# EasyEDA Pro project ProPrj_DiscoTech 6 Current_2026-05-06.epro, schematic Power Supply

## Sheets
1 Transformer: Board Name: Power Supply; Create Date: 2025-11-03; Page Name: Transformer; Project Name: Bozak Clone Rev 7; Schematic Name: Power Supply; Update Date: 2025-11-05; Company: EasyEDA.com; Page Size: A4; Version: V1.0
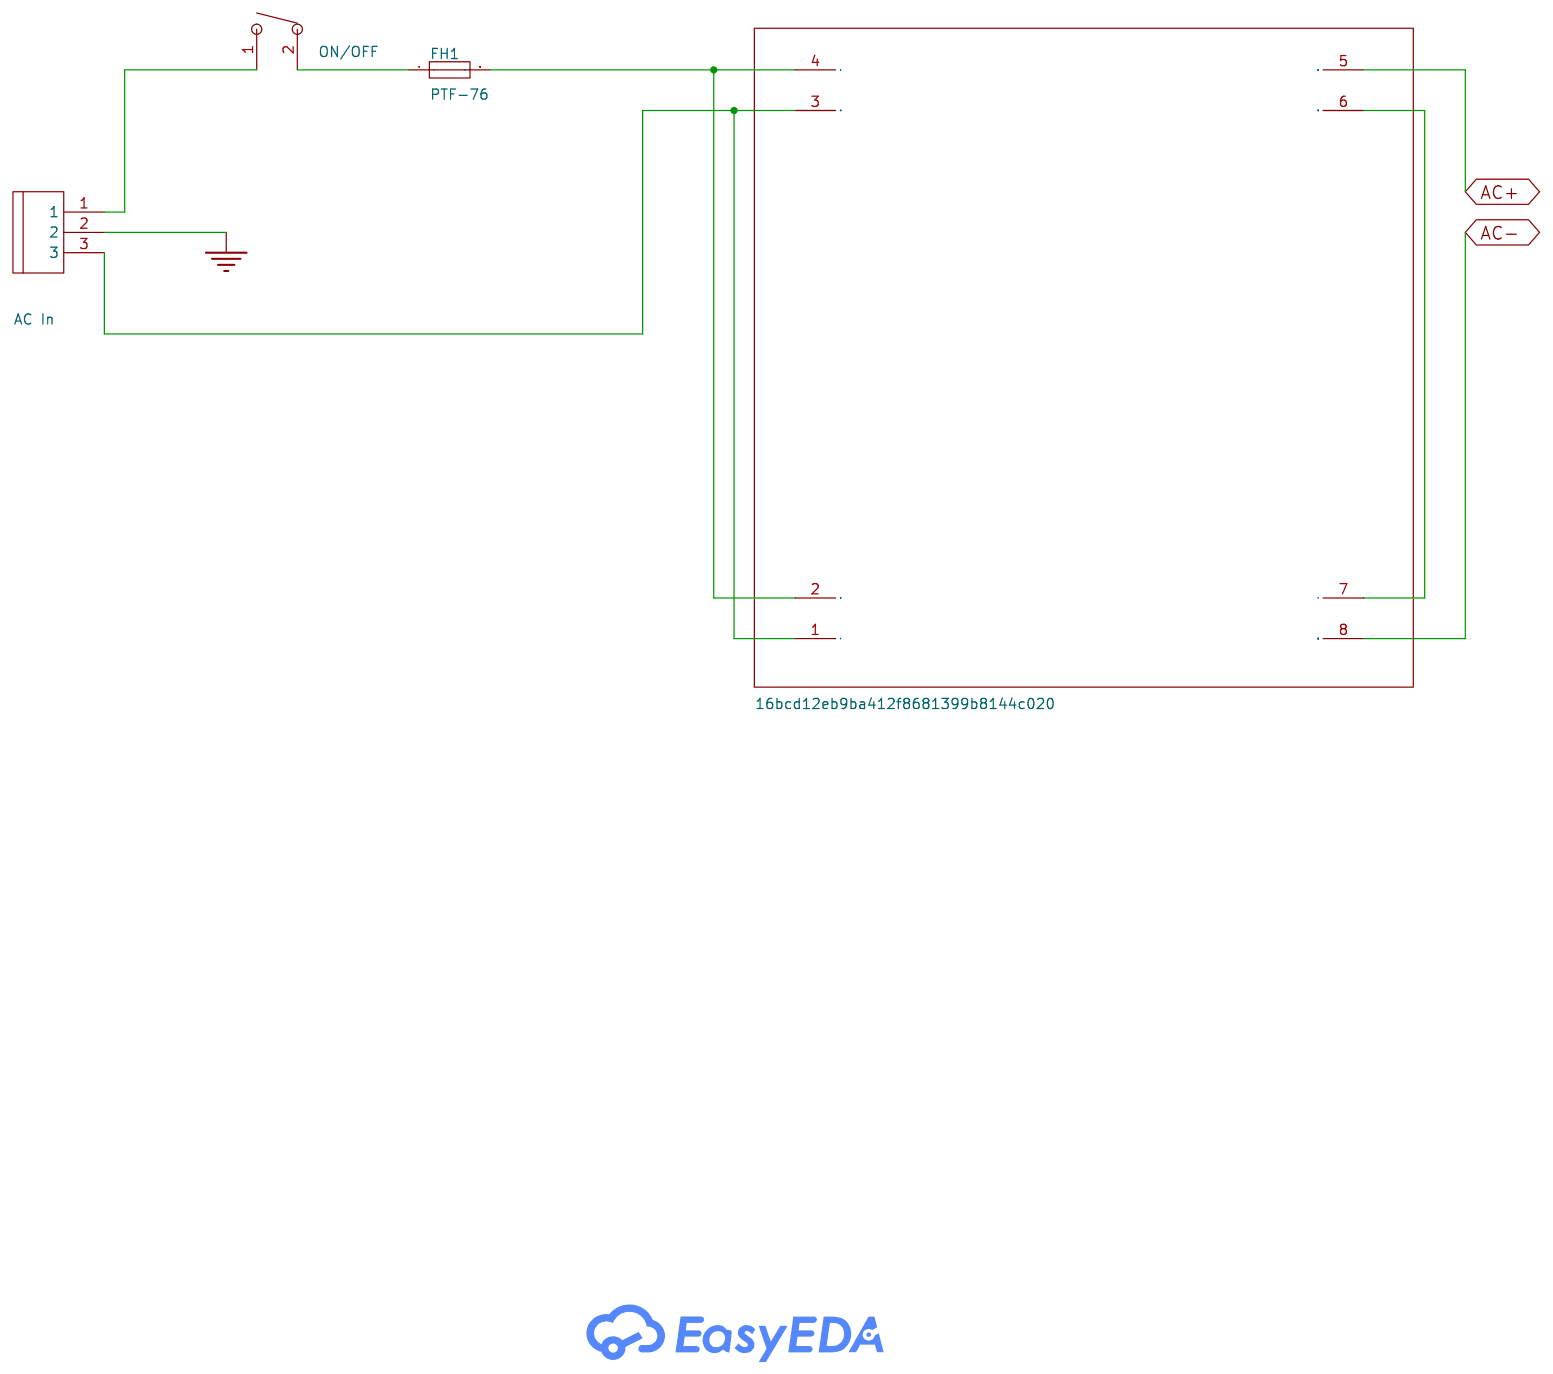
[diagram p12: Transformer]
2 Rectifier: Create Date: 2025-11-05; Page Name: Rectifier; Update Date: 2025-11-07
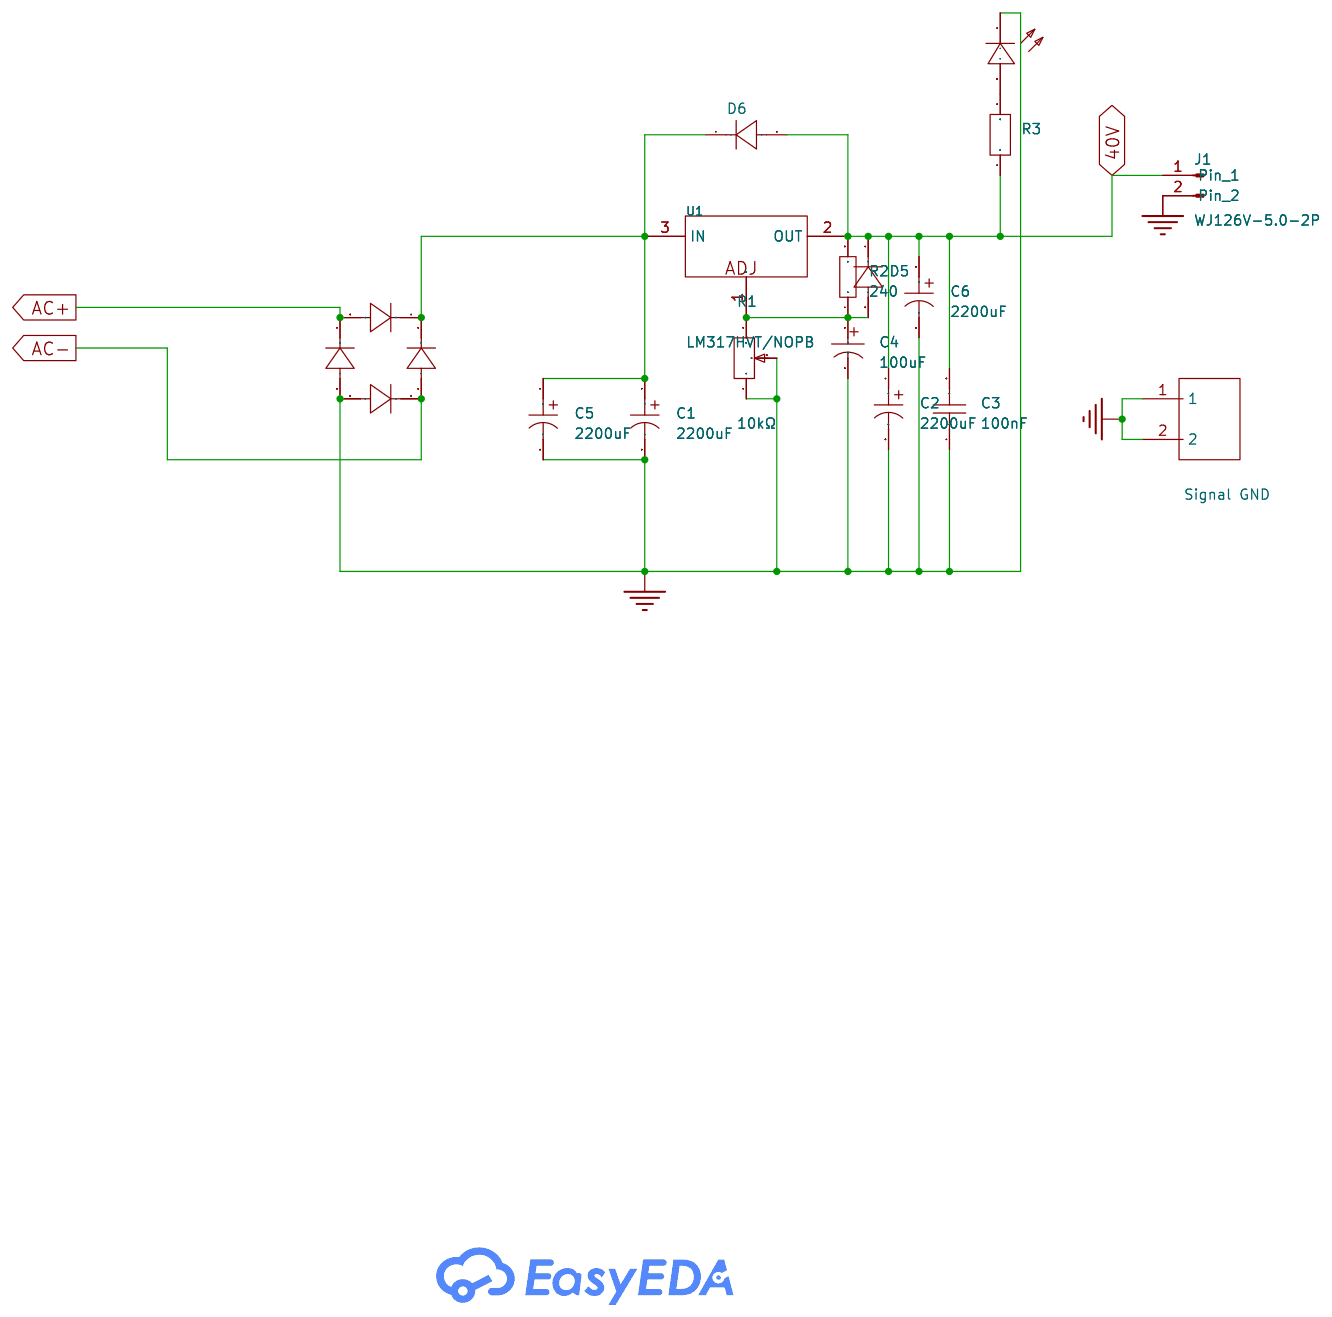
[diagram p13: Rectifier]

## Parts
sheet Rectifier
C1  2200uF  [CAP-TH_BD16.0-P7.50-D1.2-FD]
C2  2200uF  [CAP-TH_BD16.0-P7.50-D1.2-FD]
C3  100nF  [CAP-TH_L7.0-W3.2-P5.08-D0.6-S2.7]
C4  100uF  [CAP-TH_BD8.0-P3.50-D0.6-FD_1]
C5  2200uF  [CAP-TH_BD16.0-P7.50-D1.2-FD]
C6  2200uF  [CAP-TH_BD16.0-P7.50-D1.2-FD]
D1  MUR420  [DO-201AD_BD5.3-L8.4-P12.50-D1.4-RD]
D2  MUR420  [DO-201AD_BD5.3-L8.4-P12.50-D1.4-RD]
D3  MUR420  [DO-201AD_BD5.3-L8.4-P12.50-D1.4-RD]
D4  MUR420  [DO-201AD_BD5.3-L8.4-P12.50-D1.4-RD]
D5  -  [DO-41_BD2.4-L4.7-P8.70-D0.9-RD]
D6  -  [DO-41_BD2.4-L4.7-P8.70-D0.9-RD]
D7  DB125-2.54-2P-GN-S  [CONN-TH_DB125-2.54-2P-GN]
J1  DC 40v  [CONN-TH_WJ126V-5.0-2P]
P5  Signal GND  [CONN-TH_WJ126V-5.0-2P]
R1  10kΩ  [RES-ADJ-TH_3296W]
R2  240  [RES-TH_BD2.2-L6.5-P10.50-D0.6]
R3  2.2kΩ  [RES-TH_BD7.5-L18.0-P22.00-D1.0]
U1  LM317HVT/NOPB  [TO-220-3_L10.0-W4.5-P2.54-L]
sheet Transformer
CN2  AC In  [CONN-TH_3P-P5.0-MX301-5.0-03P-BU01-CU-Y-A]
FH1  PTF-76  [FUSE-TH_L25.2-W9.8_PTF-76]
SW1  ON/OFF  [CONN-TH_WJ126V-5.0-2P]
T1  16bcd12eb9ba412f8681399b8144c020  [Power Transformer 70084k]

## Library data of the parts
C1 C2 C5 C6 = UPW1V222MHD: Capacitance:2200uF Tolerance:±20% Tolerance:±20% Voltage Rating:35V Ripple Current:3.01A@100kHz Equivalent Series Resistance(ESR):18mΩ@100kHz Pin Spacing:7.5mm Diameter:16mm Height - Seated (Max):31.5mm Lifetime:8000hrs@105℃; LCSC Part Name: 2200uF ±20% 35V; Supplier Part: C225868; Manufacturer: Nichicon(尼吉康); Supplier Footprint: 插件,D16xL31.5mm; JLCPCB Part Class: Extended Part; Datasheet: https://item.szlcsc.com/datasheet/UPW1V222MHD/226115.html; Supplier: LCSC; Tolerance: ±20%; Voltage Rating: 35V; Ripple Current: 3.01A@100kHz; Equivalent Series Resistance(ESR): 18mΩ@100kHz; Pin Spacing: 7.5mm; Diameter: 16mm; Height - Seated (Max): 31.5mm; Lifetime: 8000hrs@105℃; Lifetime @ Temp: 1000hrs@105℃
C3 = CC2A104ZC1ED3F7C1100: Capacitance:100nF Tolerance:-20%~+80% Tolerance:-20%~+80% Voltage Rating:100V Pin Spacing:5.08mm Temperature Coefficient:Y5V Diameter:7mm Body Thickness:3.2mm; LCSC Part Name: 100nF -20%~+80% 100V; Supplier Part: C2761731; Manufacturer: Dersonic(德尔创); Supplier Footprint: 插件,P=5.08mm; JLCPCB Part Class: Extended Part; Datasheet: https://atta.szlcsc.com/upload/public/pdf/source/20211025/79DEC33D28BA1018911778D1C5234A9E.pdf; Supplier: LCSC; Tolerance: -20%~+80%; Voltage Rating: 100V; Pin Spacing: 5.08mm; Temperature Coefficient: Y5V; Diameter: 7mm; Body Thickness: 3.2mm
C4 = 63ZLH100MEFC8X16: Capacitance: Tolerance:±20% Tolerance:±20% Rated Voltage: Lead Spacing: φD: L: Lifetime @ Temp:8000hrs@105℃ Operating Temperature:-40℃~+105℃ Operating Temperature:-40℃~+105℃; LCSC Part Name: 100uF ±20% 63V; Supplier Part: C88747; Manufacturer: rubycon(红宝石); Supplier Footprint: 插件,D8xL16mm; JLCPCB Part Class: Extended Part; Datasheet: https://atta.szlcsc.com/upload/public/pdf/source/20171014/C110139_15079752582951037917.pdf; Supplier: LCSC; Tolerance: ±20%; Lifetime @ Temp: 8000hrs@105℃; Operating Temperature: -40℃~+105℃
D1-D4 = MUR420: Diode Configuration:Independent Voltage - Forward(Vf@If):890mV@4A Voltage - DC Reverse(Vr):200V Current - Rectified:4A Reverse Leakage Current (Ir):5uA@200V Reverse Recovery Time (trr):25ns Operating Junction Temperature Range:-55℃~+150℃@(Tj) Operating Ju; LCSC Part Name: 耐压:200V 电流:4A 反向恢复时间：25ns; Supplier Part: C698744; Manufacturer: YANGJIE(扬杰); Supplier Footprint: DO-27; JLCPCB Part Class: Extended Part; Datasheet: https://item.szlcsc.com/datasheet/MUR420/733436.html; Supplier: LCSC; Diode Configuration: Independent; Voltage - Forward(Vf@If): 890mV@4A; Voltage - DC Reverse(Vr): 200V; Current - Rectified: 4A; Reverse Leakage Current (Ir): 5uA@200V; Reverse Recovery Time (trr): 25ns; Operating Junction Temperature Range: -55℃~+150℃@(Tj); Non-Repetitive Peak Forward Surge Current: 125A
D5 D6 = 1N4007: Supplier Footprint: DO-41
D7 = DB125-2.54-2P-GN-S: Number of Positions or Pins:1x2P Pitch:2.54mm Color:Green Mounting Type:Through Hole Number of Pins:2P Number of Rows:1 Number of PINs Per Row:2 Current Rating:7A Voltage Rating (Max):150V Wire Gauge - AWG:18~26 Wire Gauge - AWG:18~26 Wire Gauge - mm2:1 W; LCSC Part Name: 1x2P 2.54mm 直插 排数:1 每排P数:2; Supplier Part: C918120; Manufacturer: DORABO(地博电气); Supplier Footprint: 插件,P=2.54mm; JLCPCB Part Class: Extended Part; Datasheet: https://item.szlcsc.com/datasheet/DB125-2.54-2P-GN-S/993699.html; Supplier: LCSC; Number of Positions or Pins: 1x2P; Pitch: 2.54mm; Color: Green; Mounting Type: Through Hole; Number of Pins: 2P; Number of Rows: 1; Number of PINs Per Row: 2; Current Rating: 7A; Voltage Rating (Max): 150V; Wire Gauge - AWG: 18~26; Wire Gauge - mm2: 1; Operating Temperature: -40℃~+105℃
J1 = WJ126V-5.0-2P: Structure:1x2P Pitch:5mm Color:Green Mounting Style:Straight Current Rating (Max):18A Voltage Rating (Max):250V Number of Pins:2P Number of Rows:1 Wire Gauge - AWG:14~26 Wire Gauge - AWG:14~26 Wire Gauge - mm2:2.5 Wire Gauge - mm2:2.5 Number of PINs Per R; LCSC Part Name: 5mm 1x2P 排数:1 每排P数:2 直插; Supplier Part: C8404; Manufacturer: KANGNEX(康奈克斯电气); Supplier Footprint: 插件,P=5mm; JLCPCB Part Class: Extended Part; Datasheet: https://atta.szlcsc.com/upload/public/pdf/source/20191225/C8404_8F52D87DF851D149A4DEA9BD9FA83F9A.pdf; Supplier: LCSC; Structure: 1x2P; Pitch: 5mm; Color: Green; Mounting Style: Straight; Current Rating (Max): 18A; Voltage Rating (Max): 250V; Number of Pins: 2P; Number of Rows: 1; Wire Gauge - AWG: 14~26; Wire Gauge - mm2: 2.5; Number of PINs Per Row: 2; Operating Temperature Range: -40℃~+105℃; Users: REF**
P5 = WJ126V-5.0-2P: Structure:1x2P Pitch:5mm Color:Green Mounting Style:Straight Current Rating (Max):18A Voltage Rating (Max):250V Number of Pins:2P Number of Rows:1 Wire Gauge - AWG:14~26 Wire Gauge - AWG:14~26 Wire Gauge - mm2:2.5 Wire Gauge - mm2:2.5 Number of PINs Per R; LCSC Part Name: 5mm 1x2P 排数:1 每排P数:2 直插; Supplier Part: C8404; Manufacturer: KANGNEX(康奈克斯电气); Supplier Footprint: 插件,P=5mm; JLCPCB Part Class: Extended Part; Datasheet: https://atta.szlcsc.com/upload/public/pdf/source/20191225/C8404_8F52D87DF851D149A4DEA9BD9FA83F9A.pdf; Supplier: LCSC; Structure: 1x2P; Pitch: 5mm; Color: Green; Mounting Style: Straight; Current Rating (Max): 18A; Voltage Rating (Max): 250V; Number of Pins: 2P; Number of Rows: 1; Wire Gauge - AWG: 14~26; Wire Gauge - mm2: 2.5; Number of PINs Per Row: 2; Operating Temperature Range: -40℃~+105℃
R1 = 3296W-1-103LF: Resistance: Tolerance:±10% Tolerance:±10% Power(Watts): Temperature Coefficient:±100ppm/℃ Temperature Coefficient:±100ppm/℃ Turns:; LCSC Part Name: 10kΩ ±10%; Supplier Part: C34846; Manufacturer: BOURNS; Supplier Footprint: SIP-3P,9.5x4.8mm; JLCPCB Part Class: Extended Part; Datasheet: https://atta.szlcsc.com/upload/public/pdf/source/20151026/1457707506403.pdf; Supplier: LCSC; Tolerance: ±10%; Temperature Coefficient: ±100ppm/℃
R2 = Res_0603: Supplier Footprint: 0603
R3 = AC05000002201JAC00: Type:Wirewound Resistor Resistance:2.2kΩ Tolerance:±5% Tolerance:±5% Power(Watts):5W Temperature Coefficient:+100ppm/℃~+180ppm/℃ Temperature Coefficient:+100ppm/℃~+180ppm/℃ Operating Temperature:-40℃~+275℃ Operating Temperature:-40℃~+275℃; LCSC Part Name: 绕线电阻 2.2kΩ ±5% 5W; Supplier Part: C1364833; Manufacturer: VISHAY(威世); Supplier Footprint: 插件,D7.5xL18mm; JLCPCB Part Class: Extended Part; Datasheet: https://atta.szlcsc.com/upload/public/pdf/source/20210425/6417D1974B7AC1ACD50BE8B569E7D9C6.pdf; Supplier: LCSC; Type: Wirewound Resistor; Tolerance: ±5%; Power(Watts): 5W; Temperature Coefficient: +100ppm/℃~+180ppm/℃; Operating Temperature: -40℃~+275℃
U1 = LM317HVT/NOPB: Output Type: Maximum Input Voltage:60V Output Voltage:1.25V~57V Output Voltage:1.25V~57V MAX Output Current:1.5A Power Supply Rejection Ratio (PSRR):80dB@(120Hz) Dropout Voltage:- standby current:12mA Operating Temperature:0℃~+125℃ Operating Temperature:0; LCSC Part Name: ADJ 输入60V 输出1.25V~57V 1.5A; Supplier Part: C468256; Manufacturer: TI(德州仪器); Supplier Footprint: TO-220; JLCPCB Part Class: Extended Part; Datasheet: https://www.ti.com/cn/lit/gpn/lm317hv; Supplier: LCSC; Maximum Input Voltage: 60V; Output Voltage: 1.25V~57V; MAX Output Current: 1.5A; Power Supply Rejection Ratio (PSRR): 80dB@(120Hz); standby current: 12mA; Operating Temperature: 0℃~+125℃; Output Polarity: Positive electrode; Number of Outputs: 1
CN2 = MX301-5.0-03P-GN01-Cu-Y-A: Number of Positions or Pins:1x3P Pitch:5mm Color:Green Mounting Type:Through Hole Number of Pins:3P Number of Rows:1 Number of PINs Per Row:3 Screw Specification:M2.5 Current Rating:16A Voltage Rating (Max):300V Wire Gauge - AWG:14~24 Wire Gauge - AWG:14~; LCSC Part Name: 1x3P 5mm 直插 排数:1 每排P数:3; Supplier Part: C5188425; Manufacturer: MAX(迈旭); Supplier Footprint: 插件,P=5mm; JLCPCB Part Class: Extended Part; Datasheet: https://item.szlcsc.com/datasheet/MX301-5.0-03P-GN01-Cu-Y-A/5862509.html; Supplier: LCSC; Number of Positions or Pins: 1x3P; Pitch: 5mm; Color: Green; Mounting Type: Through Hole; Number of Pins: 3P; Number of Rows: 1; Number of PINs Per Row: 3; Screw Specification: M2.5; Current Rating: 16A; Voltage Rating (Max): 300V; Wire Gauge - AWG: 14~24; Wire Gauge - mm2: 1.5; Operating Temperature: -40℃~+105℃
FH1 = PTF-76: Voltage Rating:250V Current Rating:15A; LCSC Part Name: 两件套 保险丝夹5*20绿色（两件套）脚距15mm; Supplier Part: C22465956; Manufacturer: XFCN(兴飞); Supplier Footprint: 插件,P=14mm; JLCPCB Part Class: Extended Part; Datasheet: https://atta.szlcsc.com/upload/public/pdf/source/20240617/208530D03180422CF8CA3A81DB1F3783.pdf; Supplier: LCSC; Voltage Rating: 250V; Current Rating: 15A
SW1 = WJ126V-5.0-2P: Structure:1x2P Pitch:5mm Color:Green Mounting Style:Straight Current Rating (Max):18A Voltage Rating (Max):250V Number of Pins:2P Number of Rows:1 Wire Gauge - AWG:14~26 Wire Gauge - AWG:14~26 Wire Gauge - mm2:2.5 Wire Gauge - mm2:2.5 Number of PINs Per R; LCSC Part Name: 5mm 1x2P 排数:1 每排P数:2 直插; Supplier Part: C8404; Manufacturer: KANGNEX(康奈克斯电气); Supplier Footprint: 插件,P=5mm; JLCPCB Part Class: Extended Part; Datasheet: https://atta.szlcsc.com/upload/public/pdf/source/20191225/C8404_8F52D87DF851D149A4DEA9BD9FA83F9A.pdf; Supplier: LCSC; Structure: 1x2P; Pitch: 5mm; Color: Green; Mounting Style: Straight; Current Rating (Max): 18A; Voltage Rating (Max): 250V; Number of Pins: 2P; Number of Rows: 1; Wire Gauge - AWG: 14~26; Wire Gauge - mm2: 2.5; Number of PINs Per Row: 2; Operating Temperature Range: -40℃~+105℃; Length: 21mm; Width: 15mm; Actuator Type: Concave-Sided curved; With Lamp: No; Termination Style: PCPin; Actuator Color: Black; Current Rating: 16A; Voltage Rating (AC): 250V; Circuit: SPST; Life: 10,000 times; Operating Temperature: -40℃~+125℃; Actuator Identifier: - O
T1 = Power Transformer 70084k

## Nets
40V: C2.1 C3.2 C6.1 D5.1(K) D6.2(A) J1.1(Pin) R2.2 R3.1 U1.2(OUT)
GNDREF: C1.2 C2.2 C3.1 C4.2 C5.2 C6.2 CN2.2 D1.2(A) D2.2(A) D7.1(-) J1.2(Pin) P5.1 P5.2 R1.1 R1.2
AC+: D2.1(K) D4.2(A) T1.5
AC-: D1.1(K) D3.2(A) T1.8
$1N222: T1.6 T1.7
$1N6929: CN2.1 SW1.1
$1N6940: CN2.3 T1.1 T1.3
$2N684: C1.1 C5.1 D3.1(K) D4.1(K) D6.1(K) U1.3(IN)
$2N685: C4.1 D5.2(A) R1.3 R2.1 U1.1(ADJ)
$2N687: D7.2(+) R3.2
Net-(FH1-1): FH1.1 SW1.2
Net-(FH1-2): FH1.2 T1.2 T1.4
